# EAGLE design ESP8266 Programmer mirror-with 5V (EAGLE 9.3.1)
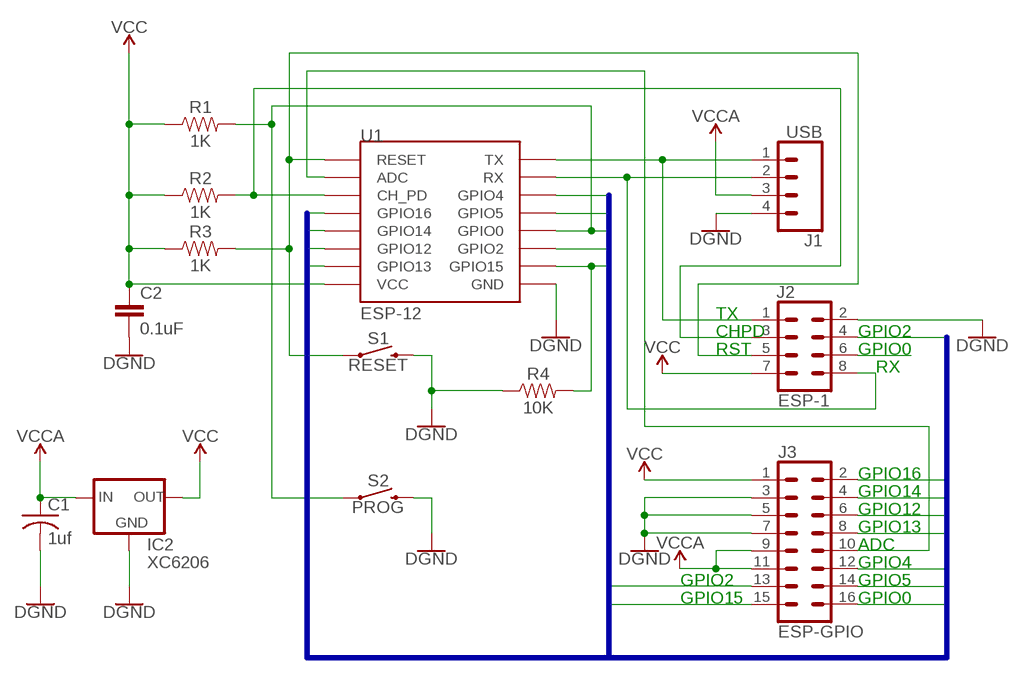
[diagram p0: schematic, sheet 1]

## Parts
C1  1uf  C-US025-040X050  [C025-040X050]
C2  0.1uF  10NF-PTH-10MM-10000V-1-%  [CAP-PTH-10MM]
IC2  XC6206  [SOT89R]
J1  USB  CONN_04  [1X04]
J2  ESP-1  CONN_04X2  [2X4]
J3  ESP-GPIO  CONN_08X2  [2X8]
R1  1K  RESISTORAXIAL-0.3-KIT  [AXIAL-0.3-KIT]
R2  1K  RESISTORAXIAL-0.3-KIT  [AXIAL-0.3-KIT]
R3  1K  RESISTORAXIAL-0.3-KIT  [AXIAL-0.3-KIT]
R4  10K  RESISTORAXIAL-0.3-KIT  [AXIAL-0.3-KIT]
S1  RESET  MOMENTARY-SWITCH-SPST-PTH-6.0MM  [TACTILE_SWITCH_PTH_6.0MM]
S2  PROG  MOMENTARY-SWITCH-SPST-PTH-6.0MM  [TACTILE_SWITCH_PTH_6.0MM]
U1  ESP-12  ESP12  [ESP12]

## Nets
GND: C1.2 C2.2 IC2.1(GND) J1.4 J2.2 J3.3 J3.5 J3.7 R4.P$1 S1.3 S2.3 U1.GND ; supply symbol labelled DGND
GPIO0: J2.6 J3.16 R1.P$2 S2.1 U1.GPIO0
GPIO2: J2.4 J3.13 U1.GPIO2
GPIO4: J3.12 U1.GPIO4
GPIO5: J3.14 U1.GPIO5
GPIO12: J3.6 U1.GPIO12
GPIO13: J3.8 U1.GPIO13
GPIO14: J3.4 U1.GPIO14
GPIO15: J3.15 R4.P$2 U1.GPIO15
GPIO16: J3.2 U1.GPIO16
N$1: J2.5 R3.P$2 S1.1 U1.RESET
N$3: J2.3 R2.P$2 U1.CH_PD
N$4: J1.1 J2.1 U1.TX
N$5: J1.2 J2.8 U1.RX
N$6: J3.10 U1.ADC
VCC: C2.1 IC2.2(OUT) J2.7 J3.1 R1.P$1 R2.P$1 R3.P$1 U1.VCC
VCCA: C1.1 IC2.3(IN) IC2.4(IN) J1.3 J3.9 J3.11

## Buses
GPIO[0..16]

## Notes on the sheet
- TX
- CHPD | GPIO2
- RST | GPIO0
- RX
- GPIO16
- GPIO14
- GPIO12
- GPIO13
- ADC
- GPIO4
- GPIO2 | GPIO5
- GPIO15 | GPIO0

## Library data of the parts
C1 = rcl:C-US: CAPACITOR, American symbol; SPICEPREFIX: C
C2 = SparkFun-Capacitors:10NF: 0.01uF/10nF/10,000pF ceramic capacitors A capacitor is a passive two-terminal electrical component used to store electrical energy temporarily in an electric field. CAP-09321; PROD_ID: CAP-09321; VALUE: 10nF
IC2 = v-reg-2-me:XC6206: VOLTAGE REGULATOR
J1 = SparkFun-Connectors:CONN_04: Multi connection point. Often used as Generic Header-pin footprint for 0.1 inch spaced/style header connections On any of the 0.1 inch spaced packages, you can populate with these: Break Away Headers - Straight <https://www.sparkfun.com/products/116> (PRT-00116) Break Away Male Headers - Right Angle <https://www.sparkfun.com/products/553> (PRT-00553) Female Headers <https://www.sparkfun.com/products/115> (PRT-00115) Break Away Headers - Machine Pin <https://www.sparkfun.com/products/117> (PRT-00117) Break Away Female Headers - Swiss Machine Pin <https://www.sparkfun.com/products/743> (PRT-00743) For SCREWTERMINALS and SPRING TERMINALS visit here: Screw Terimnals on SparkFun.com <https://www.sparkfun.com/search/results?term=Screw+Terminals> (5mm/3.5mm/2.54mm spacing) This device is also useful as a general connection point to wire up your design to another part of your project. Our various solder wires solder well into these plated through hole pads. Hook-Up Wire - Assortment (Stranded, 22 AWG) <https://www.sparkfun.com/products/11375> (PRT-11375) Hook-Up Wire - Assortment (Solid Core, 22 AWG) <https://www.sparkfun.com/products/11367> (PRT-11367) View the entire wire category on our website here <https://www.sparkfun.com/categories/141> Special notes: Molex polarized connector foot print use with SKU : PRT-08231 with associated crimp pins and housings. 1MM SMD Version SKU: PRT-10208; PROD_ID: CONN-09696
J2 = SparkFun-Connectors:CONN_04X2: Multi connection point. Often used as Generic Header-pin footprint for 0.1 inch spaced/style header connections On any of the 0.1 inch spaced packages, you can populate with these: Break Away Headers - Straight <https://www.sparkfun.com/products/116> (PRT-00116) Break Away Male Headers - Right Angle <https://www.sparkfun.com/products/553> (PRT-00553) Female Headers <https://www.sparkfun.com/products/115> (PRT-00115) Break Away Headers - Machine Pin <https://www.sparkfun.com/products/117> (PRT-00117) Break Away Female Headers - Swiss Machine Pin <https://www.sparkfun.com/products/743> (PRT-00743)
J3 = SparkFun-Connectors:CONN_08X2: Multi connection point. Often used as Generic Header-pin footprint for 0.1 inch spaced/style header connections You can populate with any combo of single row headers, but if you'd like an exact match, check this: Header - 2x8 (Male, 0.1") <https://www.sparkfun.com/products/13156> (PRT-13156) On any of the 0.1 inch spaced packages, you can populate with these: Break Away Headers - Straight <https://www.sparkfun.com/products/116> (PRT-00116) Break Away Male Headers - Right Angle <https://www.sparkfun.com/products/553> (PRT-00553) Female Headers <https://www.sparkfun.com/products/115> (PRT-00115) Break Away Headers - Machine Pin <https://www.sparkfun.com/products/117> (PRT-00117) Break Away Female Headers - Swiss Machine Pin <https://www.sparkfun.com/products/743> (PRT-00743)
R1-R4 = SparkFun-Resistors:RESISTOR: Generic Resistor Package
S1 S2 = SparkFun-Switches:MOMENTARY-SWITCH-SPST: Momentary Switch (Pushbutton) - SPST Normally-open (NO) SPST momentary switches (buttons, pushbuttons). Variants PTH-12MM - 12mm square, through-hole Momentary Pushbutton Switch - 12mm Square <https://www.sparkfun.com/products/9190> (COM-09190) PTH-6.0MM, PTH-6.0MM-KIT - 6.0mm square, through-hole Mini Pushbutton Switch <https://www.sparkfun.com/products/97> (COM-00097) KIT package intended for soldering kit's - only one side of pads' copper is exposed. PTH-RIGHT-ANGLE-KIT - Right-angle, through-hole Right Angle Tactile Button <https://www.sparkfun.com/products/10791> - Used on SparkFun BigTime Watch Kit <https://www.sparkfun.com/products/11734> SMD-12MM - 12mm square, surface-mount Tactile Button - SMD (12mm) <https://www.sparkfun.com/products/12993> (COM-12993) Used on SparkFun PicoBoard <https://www.sparkfun.com/products/11888> SMD-4.5MM - 4.5mm Square Trackball Switch Used on SparkFun Blackberry Trackballer Breakout <https://www.sparkfun.com/products/13169> SMD-4.6MMX2.8MM - 4.60mm x 2.80mm, surface mount Used on SparkFun SAMD21 Mini Breakout <https://www.sparkfun.com/products/13664> SMD-5.2MM, SMD-5.2-REDUNDANT - 5.2mm square, surface-mount Mini Pushbutton Switch - SMD <https://www.sparkfun.com/products/8720> (COM-08720) Used on Arduino Pro Mini <https://www.sparkfun.com/products/11114> REDUNDANT package connects both switch circuits together SMD-6.0X3.5MM - 6.0 x 3.5mm, surface mount Momentary Reset Switch SMD <https://www.sparkfun.com/products/8229> (COM-08229) SMD-6.2MM-TALL - 6.2mm square, surface mount Tactile Button - SMD (6mm) <https://www.sparkfun.com/products/12992> Used on SparkFun Digital Sandbox <https://www.sparkfun.com/products/12651> SMD-RIGHT-ANGLE - Right-angle, surface mount Used on SparkFun Block for Intel® Edison - Arduino <https://www.sparkfun.com/products/13036>; PROD_ID: SWCH-08441; SF_SKU: COM-00097
U1 = esp8266modules:ESP12: ESP8266 Wifi module 12

## Net classes
0 default: width 0.61 mm

## Board
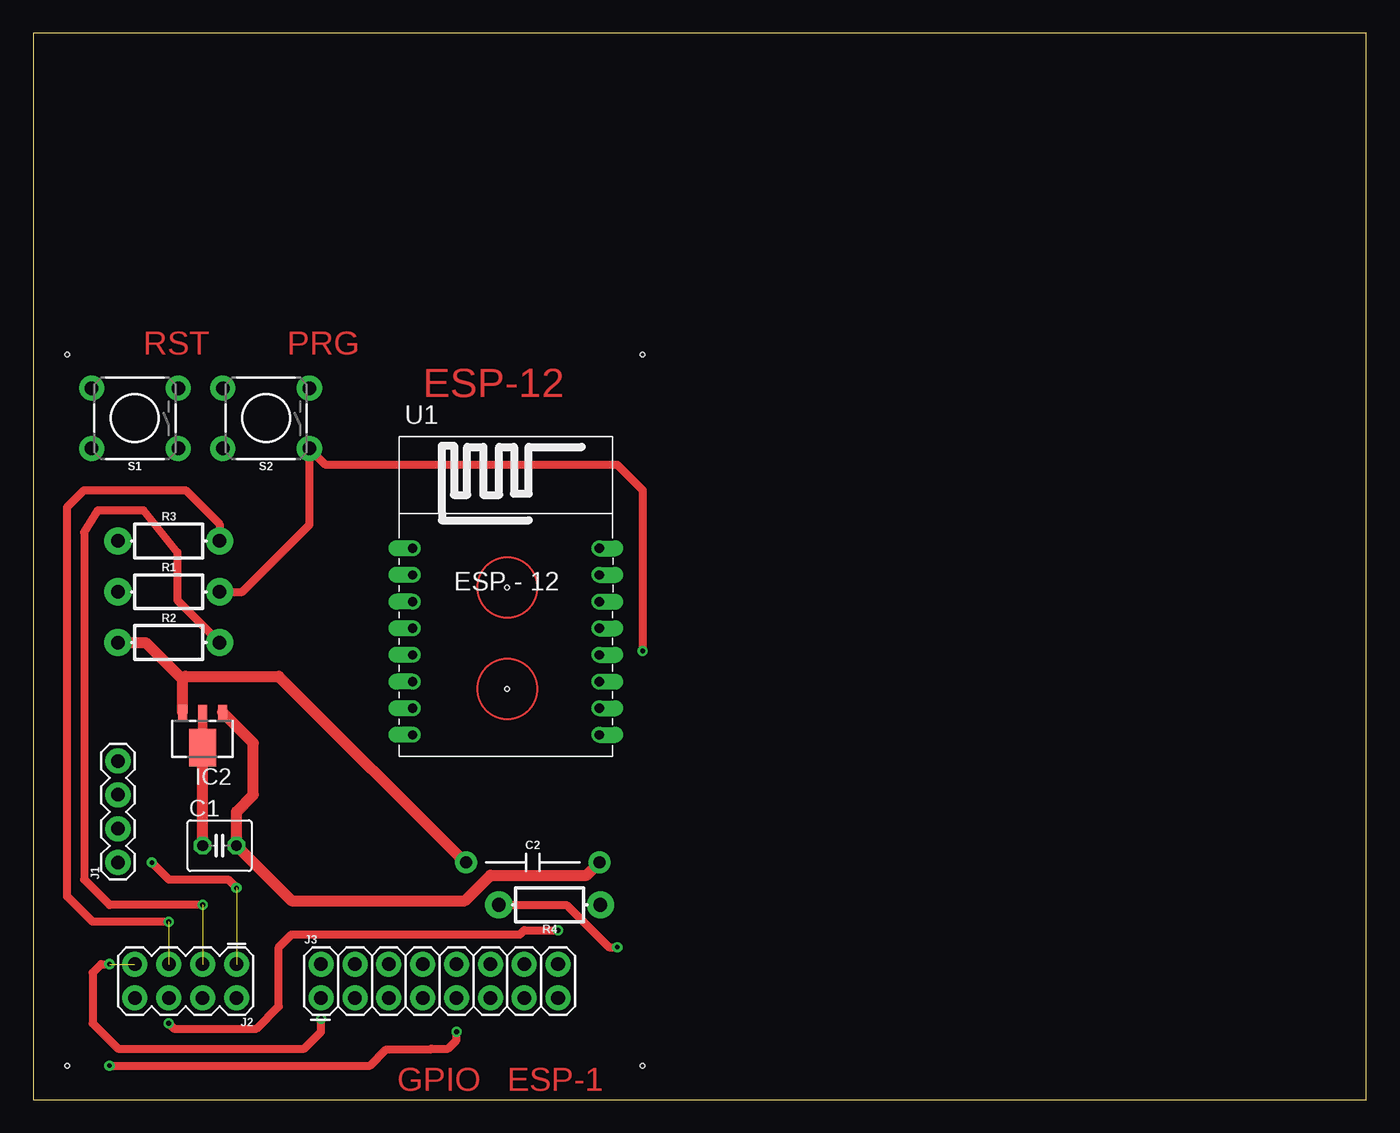
[diagram p1: board, top side]
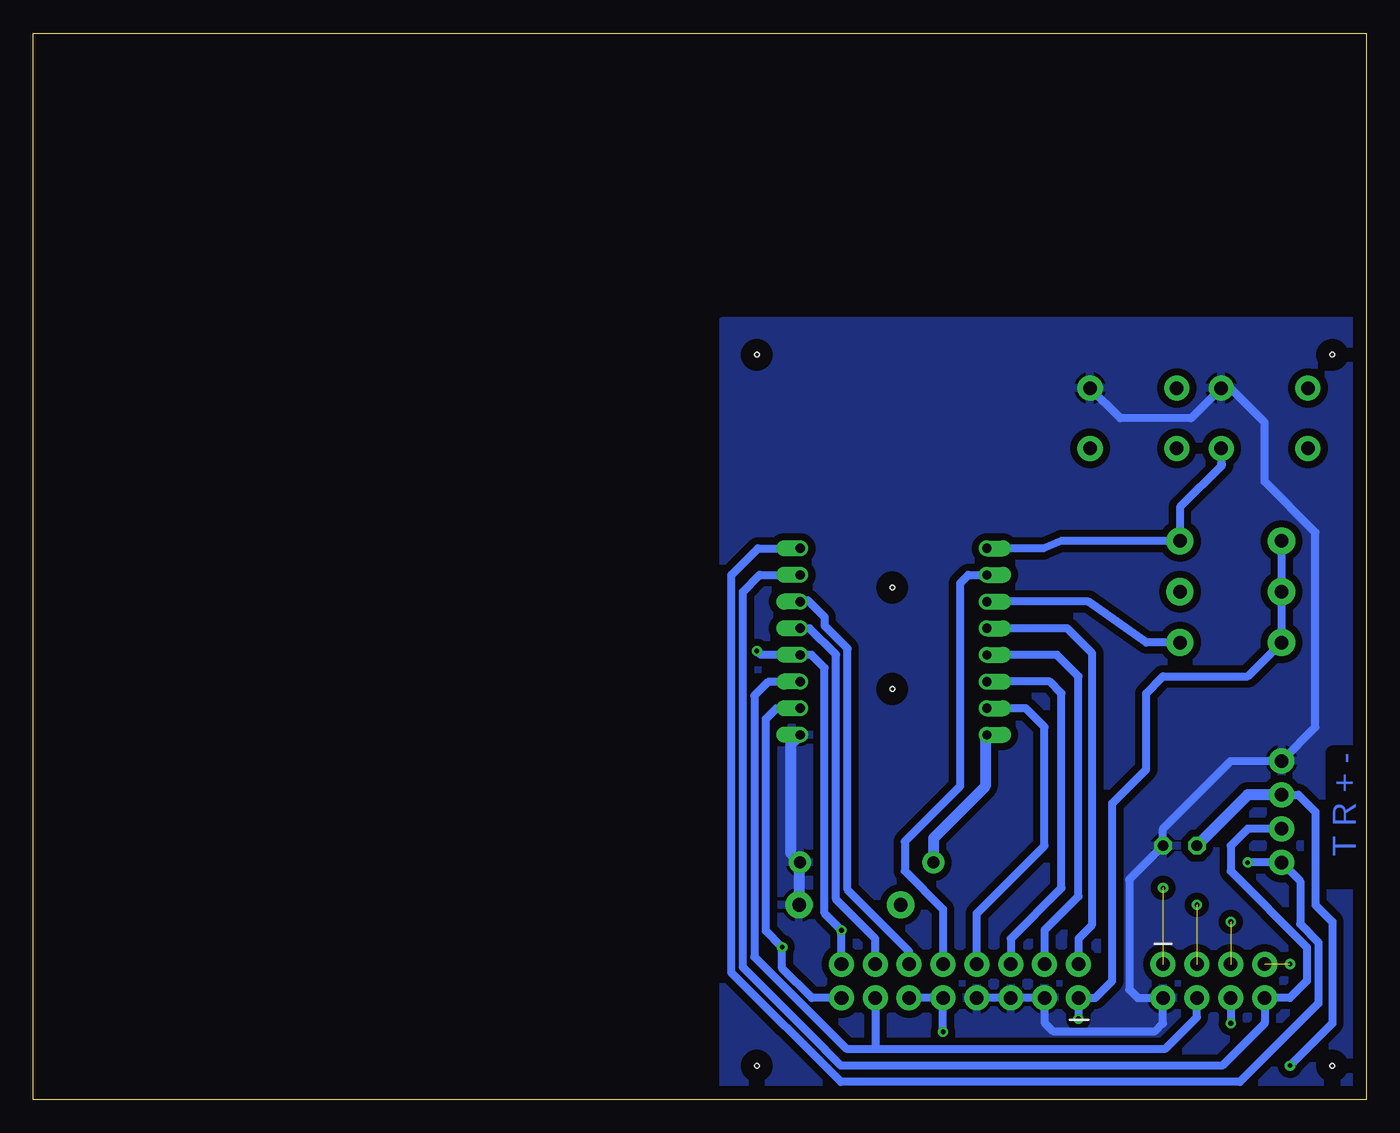
[diagram p2: board, bottom side, seen from below]

Size 100 x 80 mm. Coordinates in mm from the lower left corner, seen from the top.
Outline: 0,0 100,0 100,80 0,80 0,0
Copper layers (1*16): Top 0.035mm / dielectric 1.5mm / Bottom 0.035mm
Design rules "default *": minimum track width 6mil, minimum drill 0.35mm, track to track 10mil, track to pad 10mil, pad to pad 10mil, via to via 10mil, smd to smd 10mil, copper to edge 40mil, drill to drill 6mil, minimum pad ring 10mil, minimum via ring 8mil, stop-mask expansion 4mil, vias tented up to drill 0mil, thermal gap 10mil
Holes 0.35 mm at 2.54,55.88 45.72,55.88 45.72,2.54 2.54,2.54 35.56,38.42 35.56,30.8

### Footprints (pad centres in the part's own frame; a part is rotated, then mirrored left to right if it is on the bottom)
C025-040X050 = drill 0.813 octagon: 1 -1.27,0; 2 1.27,0
CAP-PTH-10MM = drill 0.9 pad 1.651: 1 -5,0; 2 5,0
SOT89R = smd 0.7 x 1.1: 1 -1.5,-1.75; 2 1.5,-1.75; 3 0,-1.75 | smd 2 x 2.8: 4 0,0.9
1X04 = drill 1.016 pad 1.88: 1 0,0; 2 2.54,0; 3 5.08,0; 4 7.62,0
2X4 = drill 1.016 pad 1.88: 1 -3.81,-1.27; 2 -3.81,1.27; 3 -1.27,-1.27; 4 -1.27,1.27; 5 1.27,-1.27; 6 1.27,1.27; 7 3.81,-1.27; 8 3.81,1.27
2X8 = drill 1.016 pad 1.88: 1 0,0; 2 0,2.54; 3 2.54,0; 4 2.54,2.54; 5 5.08,0; 6 5.08,2.54; 7 7.62,0; 8 7.62,2.54; 9 10.16,0; 10 10.16,2.54; 11 12.7,0; 12 12.7,2.54; 13 15.24,0; 14 15.24,2.54; 15 17.78,0; 16 17.78,2.54
AXIAL-0.3-KIT = drill 1.016 pad 2.032: P$1 -3.81,0; P$2 3.81,0
TACTILE_SWITCH_PTH_6.0MM = drill 1.016 pad 1.88: 1 -3.251,2.261; 2 3.251,2.261; 3 -3.251,-2.261; 4 3.251,-2.261
ESP12 = drill 0.7 offset: ADC -7.1,3.8; CH_PD -7.1,1.8; GND 6.9,-8.2; GPIO0 6.9,-2.2; GPIO2 6.9,-4.2; GPIO4 6.9,1.8; GPIO5 6.9,-0.2; GPIO12 -7.1,-4.2; GPIO13 -7.1,-6.2; GPIO14 -7.1,-2.2; GPIO15 6.9,-6.2; GPIO16 -7.1,-0.2; RESET -7.1,5.8; RX 6.9,3.8; TX 6.9,5.8; VCC -7.1,-8.2

### Placement (x,y rotation side)
C1  13.97,19.05 0 top
C2  37.47,17.78 0 top
IC2  12.7,27.3 180 top
J1  6.35,17.78 90 top
J2  11.43,8.89 180 top
J3  21.59,7.62 0 top
R1  10.16,38.1 0 top
R2  10.16,34.29 0 top
R3  10.16,41.91 0 top
R4  38.73,14.61 180 top
S1  7.62,51.12 180 top
S2  17.46,51.12 180 top
U1  35.56,35.56 0 top

### Tracks (layer width: path | path; a pad name or v marks a point on that pad's centre or on a via)
GND
  Top 0.813: IC2.1 16.51,26.75 16.51,22.86 15.24,21.59 C1.2 19.37,14.92 32.38,14.92 34.29,16.83 41.51,16.83 C2.2
  Bottom 0.61: J3.7 J3.5 J3.3 24.13,5.77 23.5,5.13 15.82,5.13 15.24,5.71 J2.2 17.14,7.62 17.78,8.26 17.78,16.51 C1.2 15.24,20.32 10.16,25.4 J1.4 3.81,27.94 3.81,42.55 7.62,46.35 7.62,50.8 10.2,53.38 S1.3 13.13,51.12 18.45,51.12 S2.3
  Bottom 0.813: U1.GND 43.18,26.64 43.18,18.5 C2.2 42.55,17.7 R4.P$1
  pour Bottom (isolate 0.533, rank 6): 0,58.42 48.26,58.42 48.26,0 0,0
GPIO0  (via drill 0.35)
  Top 0.61: R1.P$2 15.67,38.1 20.71,43.14 S2.1 21.95,47.62 43.81,47.62 45.72,45.72 v45.72,33.66 | v10.16,5.71 10.57,5.31 16.74,5.31 18.41,6.99 18.41,11.43 19.37,12.38 36.51,12.38 36.83,12.7 v39.37,12.7
  Bottom 0.61: J2.6 v10.16,5.71 | v45.72,33.66 45.42,33.36 U1.GPIO0 41.62,33.36 40.64,32.38 40.64,13.97 v39.37,12.7 J3.16
GPIO2
  Bottom 0.61: J2.4 12.7,6.17 15.06,3.81 36.83,3.81 | U1.GPIO2 44.84,31.36 45.9,30.3 45.9,10.7 39,3.81 36.83,3.81 | J3.13 36.83,3.81
GPIO4
  Bottom 0.61: U1.GPIO4 42.35,37.47 41.91,37.47 40.64,36.2 40.64,35.56 38.91,33.83 38.91,15.73 34.29,11.11 J3.12
GPIO5
  Bottom 0.61: U1.GPIO5 41.76,35.36 39.78,33.38 39.78,15.01 36.83,12.06 J3.14
GPIO12
  Bottom 0.61: J3.6 26.67,12.06 22.86,15.88 22.86,30.48 23.74,31.36 U1.GPIO12
GPIO13
  Bottom 0.61: J3.8 29.21,13.97 24.13,19.05 24.13,27.94 25.55,29.36 U1.GPIO13
GPIO14
  Bottom 0.61: J3.4 24.13,12.7 21.59,15.24 21.59,31.75 23.2,33.36 U1.GPIO14
GPIO15  (via drill 0.35)
  Top 0.61: R4.P$2 40.01,14.61 43.18,11.43 v43.81,11.43
  Bottom 0.61: J3.15 41.59,7.62 43.81,9.84 v43.81,11.43 45.03,12.65 45.03,28.57 44.25,29.36 U1.GPIO15
GPIO16
  Bottom 0.61: J3.2 21.59,12.06 20.55,13.11 20.55,33.48 22.43,35.36 U1.GPIO16
N$1  (via drill 0.35)  (1 unrouted)
  Top 0.61: v10.16,13.34 4.45,13.34 2.54,15.24 2.54,44.45 3.81,45.72 11.43,45.72 13.97,43.18 R3.P$2
  Bottom 0.61: U1.RESET 24.21,41.36 22.86,41.91 R3.P$2 13.97,44.45 10.79,47.62 10.87,47.7 S1.1
N$3  (via drill 0.35)  (1 unrouted)
  Top 0.61: R2.P$2 10.79,37.47 10.79,41.05 8.26,44.22 4.85,44.22 3.81,42.55 3.81,16.51 5.71,14.61 v12.7,14.61
  Bottom 0.61: R2.P$2 16.51,34.29 20.85,37.36 U1.CH_PD
N$4  (via drill 0.35)  (1 unrouted)
  Top 0.61: v15.24,15.88 14.61,16.51 10.16,16.51 v8.89,17.78
  Bottom 0.61: U1.TX 45.63,41.36 47.62,39.37 47.62,9.53 39.42,1.32 9.47,1.32 3.58,7.21 3.58,11.79 4.96,13.17 4.96,16.39 J1.1 v8.89,17.78
N$5
  Bottom 0.61: U1.RX 45.5,39.36 46.76,38.1 46.76,9.93 40.64,3.81 40.64,3.76 39.42,2.54 10.79,2.54 7.62,5.71 J2.8 5.71,7.62 4.45,8.89 4.45,9.53 4.45,11.43 10.16,17.14 10.16,19.05 8.89,20.32 J1.2
N$6
  Bottom 0.61: U1.ADC 29.84,39.37 30.48,38.73 30.48,23.5 34.61,19.37 34.61,17.14 31.75,14.29 J3.10
VCC  (via drill 0.35)  (1 unrouted)
  Top 0.61: v5.71,10.16 5.08,10.16 4.45,9.53 4.45,5.71 6.35,3.81 20.32,3.81 21.59,5.08 v21.59,6.07
  Top 0.813: 11.2,31.52 11.43,31.75 18.41,31.75 32.38,17.78 C2.1 | IC2.2 11.2,31.52 | R2.P$1 8.43,34.29 11.2,31.52
  Bottom 0.61: R3.P$1 R1.P$1 R2.P$1 8.89,31.75 15.24,31.75 16.51,30.48 16.51,24.77 19.05,22.23 19.05,8.89 20.32,7.62 J3.1 v21.59,6.07 21.59,5.99
  Bottom 0.813: U1.VCC 28.57,27.25 28.57,23.5 32.47,19.61 C2.1
VCCA  (via drill 0.35)
  Top 0.61: IC2.3 12.7,27.14 IC2.4 | v5.71,2.54 25.27,2.54 26.48,3.75 29.79,3.75 29.84,3.81 31.11,3.81 31.75,4.45 v31.75,5.08
  Top 0.813: C1.1 12.7,27.14
  Bottom 0.61: J1.3 5.08,22.86 3.81,21.59 3.81,14.61 2.54,13.34 2.54,5.71 v5.71,2.54 | v31.75,5.08 J3.9 J3.11
  Bottom 0.813: J1.3 8.89,22.86 C1.1
(copper drawn outside any net)
  shapes: Top circle x2

### Text on the board
Top: RST | PRG | ESP-12 | GPIO | ESP-1
Bottom: T R + -